# EAGLE schematic schema (EAGLE 9.6.2)
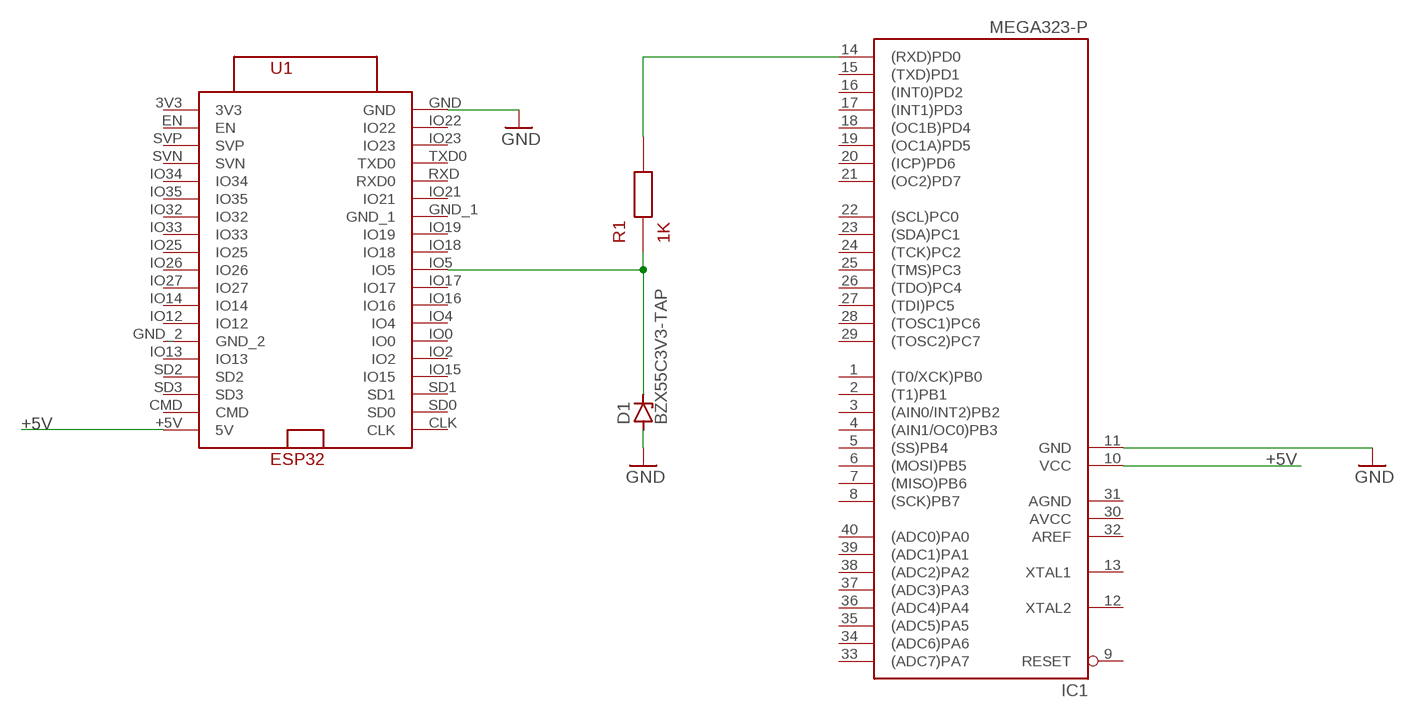
[diagram p0: schematic, sheet 1]

## Parts
D1  BZX55C3V3-TAP  BZX55  [DO35Z10]
IC1  MEGA323-P  [DIL40]
R1  1K  R  [R]
U1  ESP32  [ESP32]

## Nets
+5V: IC1.10(VCC) U1.+5V(5V)
GND: D1.A IC1.11(GND) U1.GND
N$1: D1.C R1.P$1 U1.IO5
N$2: IC1.14((RXD)PD0) R1.P$2
Unconnected: IC1.1((T0/XCK)PB0) IC1.2((T1)PB1) IC1.3((AIN0/INT2)PB2) IC1.4((AIN1/OC0)PB3) IC1.5((SS)PB4) IC1.6((MOSI)PB5) IC1.7((MISO)PB6) IC1.8((SCK)PB7) IC1.9(RESET) IC1.12(XTAL2) IC1.13(XTAL1) IC1.15((TXD)PD1) IC1.16((INT0)PD2) IC1.17((INT1)PD3) IC1.18((OC1B)PD4) IC1.19((OC1A)PD5) IC1.20((ICP)PD6) IC1.21((OC2)PD7) IC1.22((SCL)PC0) IC1.23((SDA)PC1) IC1.24((TCK)PC2) IC1.25((TMS)PC3) IC1.26((TDO)PC4) IC1.27((TDI)PC5) IC1.28((TOSC1)PC6) IC1.29((TOSC2)PC7) IC1.32(AREF) IC1.33((ADC7)PA7) IC1.34((ADC6)PA6) IC1.35((ADC5)PA5) IC1.36((ADC4)PA4) IC1.37((ADC3)PA3) IC1.38((ADC2)PA2) IC1.39((ADC1)PA1) IC1.40((ADC0)PA0) U1.CLK U1.CMD U1.EN U1.GND_1 U1.GND_2 U1.IO0 U1.IO2 U1.IO4 U1.IO12 U1.IO13 U1.IO14 U1.IO15 U1.IO16 U1.IO17 U1.IO18 U1.IO19 U1.IO21 U1.IO22 U1.IO23 U1.IO25 U1.IO26 U1.IO27 U1.IO32 U1.IO33 U1.IO34 U1.IO35 U1.RXD(RXD0) U1.SD0 U1.SD1 U1.SD2 U1.SD3 U1.SVN U1.SVP U1.TXD0

## Power pins joined to a net without a drawn wire
3V3: U1.3V3
AGND: IC1.31(AGND)
AVCC: IC1.30(AVCC)

## Library data of the parts
D1 = diode:BZX55: Z DIODE
IC1 = atmel:MEGA323-P: MICROCONTROLLER 32 Kbytes FLASH 2 Kbytes SRAM 1 Kbytes EEPROM USART 8-channel 10 bit ADC Source: avr.lbr; OC_FARNELL: unknown; OC_NEWARK: unknown
R1 = my_devices:R
U1 = my_devices:ESP32